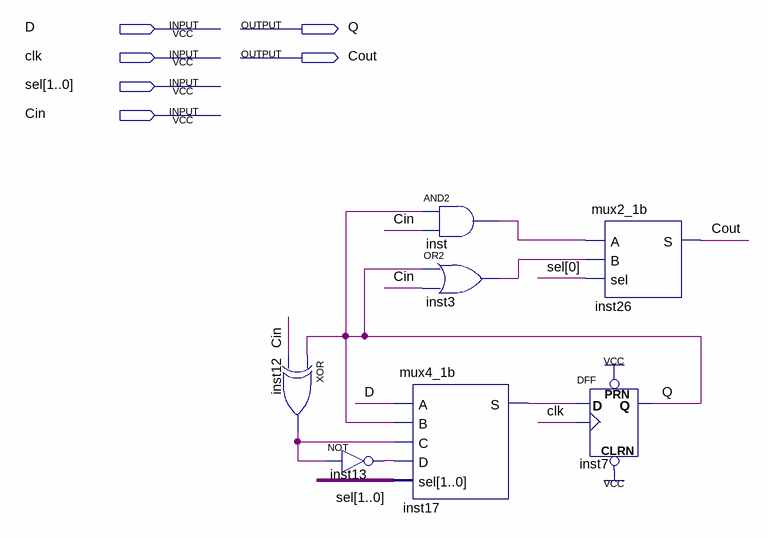
[diagram p0: schematic sheet]
// Quartus schematic counter_bit.bdf as structural Verilog: 7 symbols, 6 pins
module counter_bit (
  input  D,
  input  clk,
  input  [1:0] sel,
  input  Cin,
  output Q,
  output Cout
);

  wire inst3_out, inst12_out, inst13_out, inst17_s, inst_out;

  xor inst12 (inst12_out, Q, Cin);
  not inst13 (inst13_out, inst12_out);
  and inst (inst_out, Q, Cin);
  or inst3 (inst3_out, Q, Cin);
  mux4_1b inst17 (.A(D), .B(Q), .C(inst12_out), .D(inst13_out), .sel(sel), .S(inst17_s));
  DFF inst7 (.CLRN(1'b1), .CLK(clk), .D(inst17_s), .PRN(1'b1), .Q(Q));
  mux2_1b inst26 (.A(inst_out), .B(inst3_out), .sel(sel[0]), .S(Cout));
endmodule
